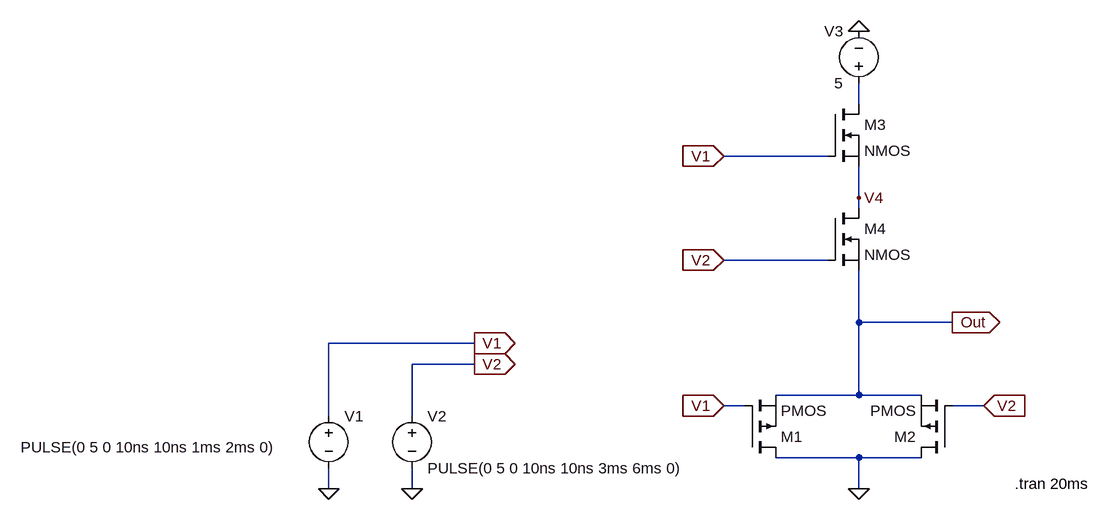
[diagram p0: schematic Porte_AND.asc]
Porte_AND.asc, the LTspice schematic file:
Version 4
SHEET 1 880 680
WIRE 464 -160 464 -192
WIRE 416 -80 256 -80
WIRE 464 -16 464 -64
WIRE 464 0 464 -16
WIRE 416 80 256 80
WIRE 464 176 464 96
WIRE 608 176 464 176
WIRE -128 208 -352 208
WIRE -128 240 -224 240
WIRE 464 288 464 176
WIRE 464 288 336 288
WIRE 560 288 464 288
WIRE 288 304 256 304
WIRE 656 304 608 304
WIRE -352 320 -352 208
WIRE -224 320 -224 240
WIRE 464 384 336 384
WIRE 560 384 464 384
WIRE -352 432 -352 400
WIRE -224 432 -224 400
WIRE 464 432 464 384
FLAG -352 432 0
FLAG -224 432 0
FLAG 464 -272 0
FLAG 464 432 0
FLAG 608 176 Out
IOPIN 608 176 Out
FLAG -128 208 V1
IOPIN -128 208 Out
FLAG -128 240 V2
IOPIN -128 240 Out
FLAG 256 -80 V1
IOPIN 256 -80 In
FLAG 256 80 V2
IOPIN 256 80 In
FLAG 256 304 V1
IOPIN 256 304 In
FLAG 656 304 V2
IOPIN 656 304 In
FLAG 464 -16 V4
SYMBOL voltage -352 304 R0
WINDOW 3 -474 64 Left 2
WINDOW 123 0 0 Left 0
WINDOW 39 0 0 Left 0
SYMATTR Value PULSE(0 5 0 10ns 10ns 1ms 2ms 0)
SYMATTR InstName V1
SYMBOL voltage -224 304 R0
WINDOW 123 0 0 Left 0
WINDOW 39 0 0 Left 0
SYMATTR InstName V2
SYMATTR Value PULSE(0 5 0 10ns 10ns 3ms 6ms 0)
SYMBOL voltage 464 -176 R180
WINDOW 0 24 96 Left 2
WINDOW 3 24 16 Left 2
WINDOW 123 0 0 Left 0
WINDOW 39 0 0 Left 0
SYMATTR InstName V3
SYMATTR Value 5
SYMBOL pmos 288 384 M180
SYMATTR InstName M1
SYMBOL pmos 608 384 R180
SYMATTR InstName M2
SYMBOL nmos 416 -160 R0
SYMATTR InstName M3
SYMBOL nmos 416 0 R0
SYMATTR InstName M4
TEXT 704 424 Left 2 !.tran 20ms

The netlist it stands for:
* Porte_AND.asc
V1 V1 0 PULSE(0 5 0 10ns 10ns 1ms 2ms 0)
V2 V2 0 PULSE(0 5 0 10ns 10ns 3ms 6ms 0)
V3 N001 0 5
M1 0 V1 Out Out PMOS
M2 0 V2 Out Out PMOS
M3 N001 V1 V4 V4 NMOS
M4 V4 V2 Out Out NMOS
.model NMOS NMOS
.model PMOS PMOS
.lib standard.mos
.tran 20ms
.backanno
.end